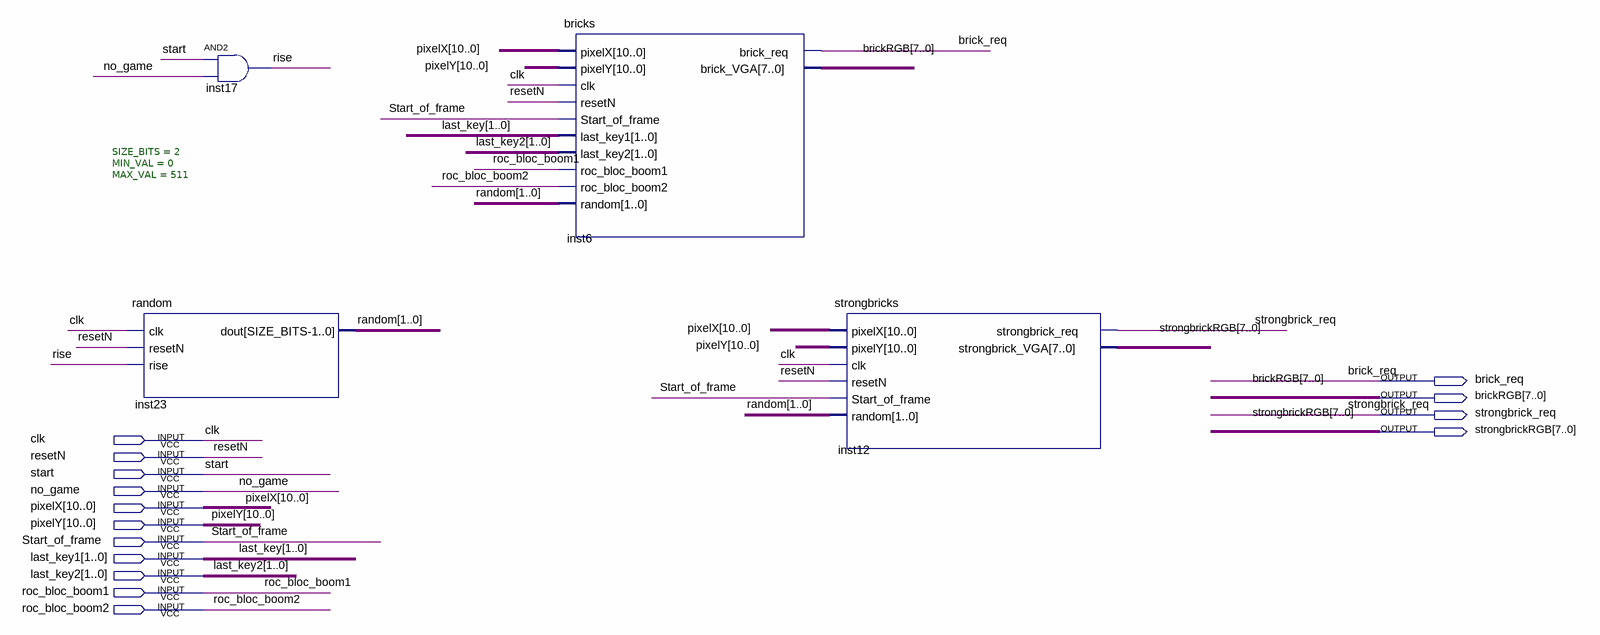
[diagram p0: schematic sheet]
// Quartus schematic TOP_BRICKS.bdf as structural Verilog: 4 symbols, 15 pins
module TOP_BRICKS (
  input  clk,
  input  resetN,
  input  start,
  input  no_game,
  input  [10:0] pixelX,
  input  [10:0] pixelY,
  input  Start_of_frame,
  input  [1:0] last_key1,
  input  [1:0] last_key2,
  input  roc_bloc_boom1,
  input  roc_bloc_boom2,
  output brick_req,
  output [7:0] brickRGB,
  output strongbrick_req,
  output [7:0] strongbrickRGB
);

  wire rise;
  wire [1:0] random;

  random #(.SIZE_BITS(2), .MIN_VAL(0), .MAX_VAL(511)) inst23 (.clk(clk), .resetN(resetN), .rise(rise), .dout(random));
  and inst17 (rise, start, no_game);
  bricks inst6 (
    .pixelX(pixelX), .pixelY(pixelY), .clk(clk), .resetN(resetN), .Start_of_frame(Start_of_frame),
    .last_key1(last_key1), .last_key2(last_key2), .roc_bloc_boom1(roc_bloc_boom1),
    .roc_bloc_boom2(roc_bloc_boom2), .random(random), .brick_req(brick_req), .brick_VGA(brickRGB));
  strongbricks inst12 (
    .pixelX(pixelX), .pixelY(pixelY), .clk(clk), .resetN(resetN), .Start_of_frame(Start_of_frame),
    .random(random), .strongbrick_req(strongbrick_req), .strongbrick_VGA(strongbrickRGB));

  // Other names for the same wires on the sheet: last_key[1:0] = last_key1
endmodule
